# Altium schematic sheet battery-select.SchDoc: Battery Selection
size A4; Date: 23 Sept 2024; Author: Aaron Huinink; CompanyName: FLoRa Communications; DrawnBy: Aaron Huinink; Revision: 1; SheetNumber: 5; SheetTotal: 5; Time: 16:30
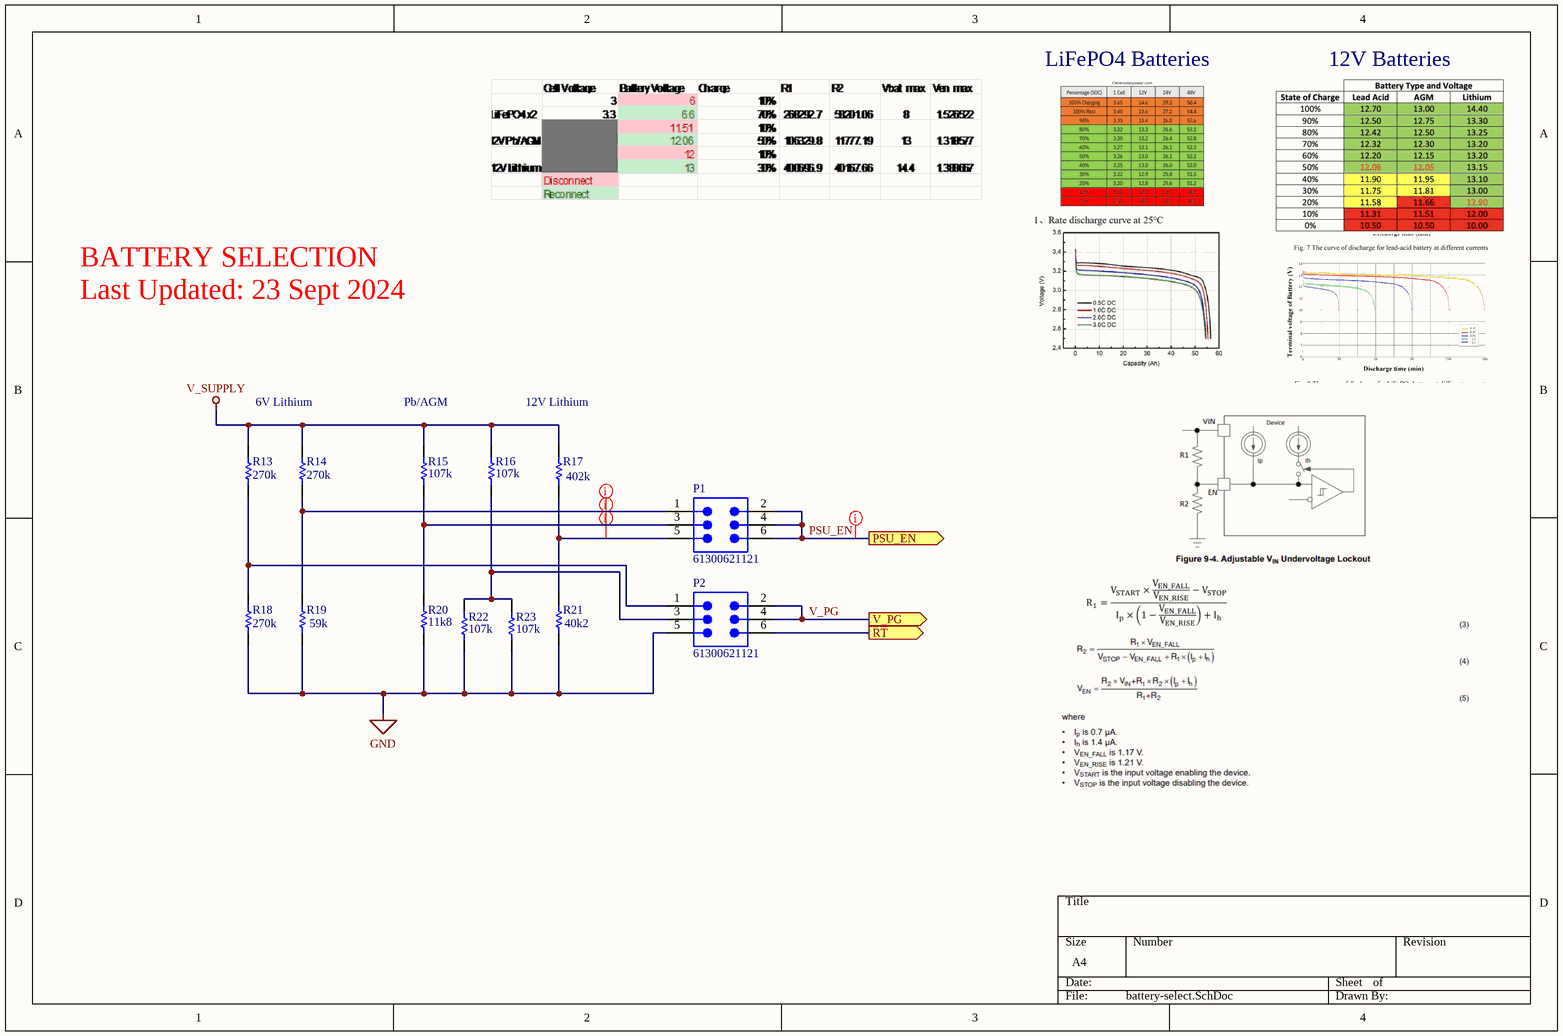
[diagram p0: battery-select.SchDoc]

## Parts
P1  61300621121  [61300621121]
P2  61300621121  [61300621121]
R13  value 270k  [RESC2013X70X40LL20T20]  (hidden comment: ERJ6ENF2703V)
R14  value 270k  [RESC2013X70X40LL20T20]  (hidden comment: ERJ6ENF2703V)
R15  value 107k  [RESC2013X70X40LL20T20]  (hidden comment: ERJ-6ENF1073V)
R16  value 107k  [RESC2013X70X40LL20T20]  (hidden comment: ERJ-6ENF1073V)
R17  value 402k  [RESC2013X70X40LL20T20]  (hidden comment: ERJ-6ENF4023V)
R18  value 270k  [RESC2013X70X40LL20T20]  (hidden comment: ERJ6ENF2703V)
R19  value 59k  [RESC2013X70X40LL20T20]  (hidden comment: ERJ-6ENF5902V)
R20  value 11k8  [RESC2013X70X40LL20T20]  (hidden comment: ERJ-6ENF1182V)
R21  value 40k2  [RESC2013X70X40LL20T20]  (hidden comment: ERJ-6ENF4022V)
R22  value 107k  [RESC2013X70X40LL20T20]  (hidden comment: ERJ-6ENF1073V)
R23  value 107k  [RESC2013X70X40LL20T20]  (hidden comment: ERJ-6ENF1073V)

## Ports
PSU_EN (out), RT (out), V_PG (out)

## Nets
GND: P2.5 R18.1 R19.1 R20.1 R21.1 R22.1 R23.1
V_SUPPLY: R13.2 R14.2 R15.2 R16.2 R17.2
PSU_EN: P1.2 P1.4 P1.6 ; port PSU_EN
RT: P2.6 ; port RT
V_PG: P2.2 P2.4 ; port V_PG
NetP1_1: P1.1 R14.1 R19.2
NetP1_3: P1.3 R15.1 R20.2
NetP1_5: P1.5 R17.1 R21.2
NetP2_1: P2.1 R13.1 R18.2
NetP2_3: P2.3 R16.1 R22.2 R23.2

## Layout directives
net class ANALOG: NetP1_1, NetP1_3, NetP1_5, PSU_EN

## Notes on the sheet
- LiFePO4 Batteries
- 12V Batteries
- BATTERY SELECTION
  Last Updated: 23 Sept 2024
- 6V Lithium
- Pb/AGM
- 12V Lithium

## Library data of the parts
P1 P2 = CMP-002-00112-1: Board Connector, 6 Contact(s), 2 Row(s), Male, Straight, 0.1 inch Pitch, Solder Terminal, Black Insulator, Plug; Max Operating Temperature: 125°C; Mounting Technology: Board; Connector Type: BOARD CONNECTOR; Min Operating Temperature: -40°C; RoHS Compliant: Yes
R13 R14 R18 = CMP-2001-00528-1: Manufacturer: Panasonic; Part Number: ERJ6ENF2703V
R15 R16 R22 R23 = CMP-2001-04390-1: Manufacturer: Panasonic; Part Number: ERJ-6ENF1073V
R17 = CMP-2001-00170-1: Manufacturer: Panasonic; Part Number: ERJ-6ENF4023V
R19 = CMP-2001-00247-1: Manufacturer: Panasonic; Part Number: ERJ-6ENF5902V
R20 = CMP-2001-04399-1: Manufacturer: Panasonic; Part Number: ERJ-6ENF1182V
R21 = CMP-2001-00169-1: Manufacturer: Panasonic; Part Number: ERJ-6ENF4022V